# EAGLE schematic DinoCalc_1v0 (EAGLE 6.4)
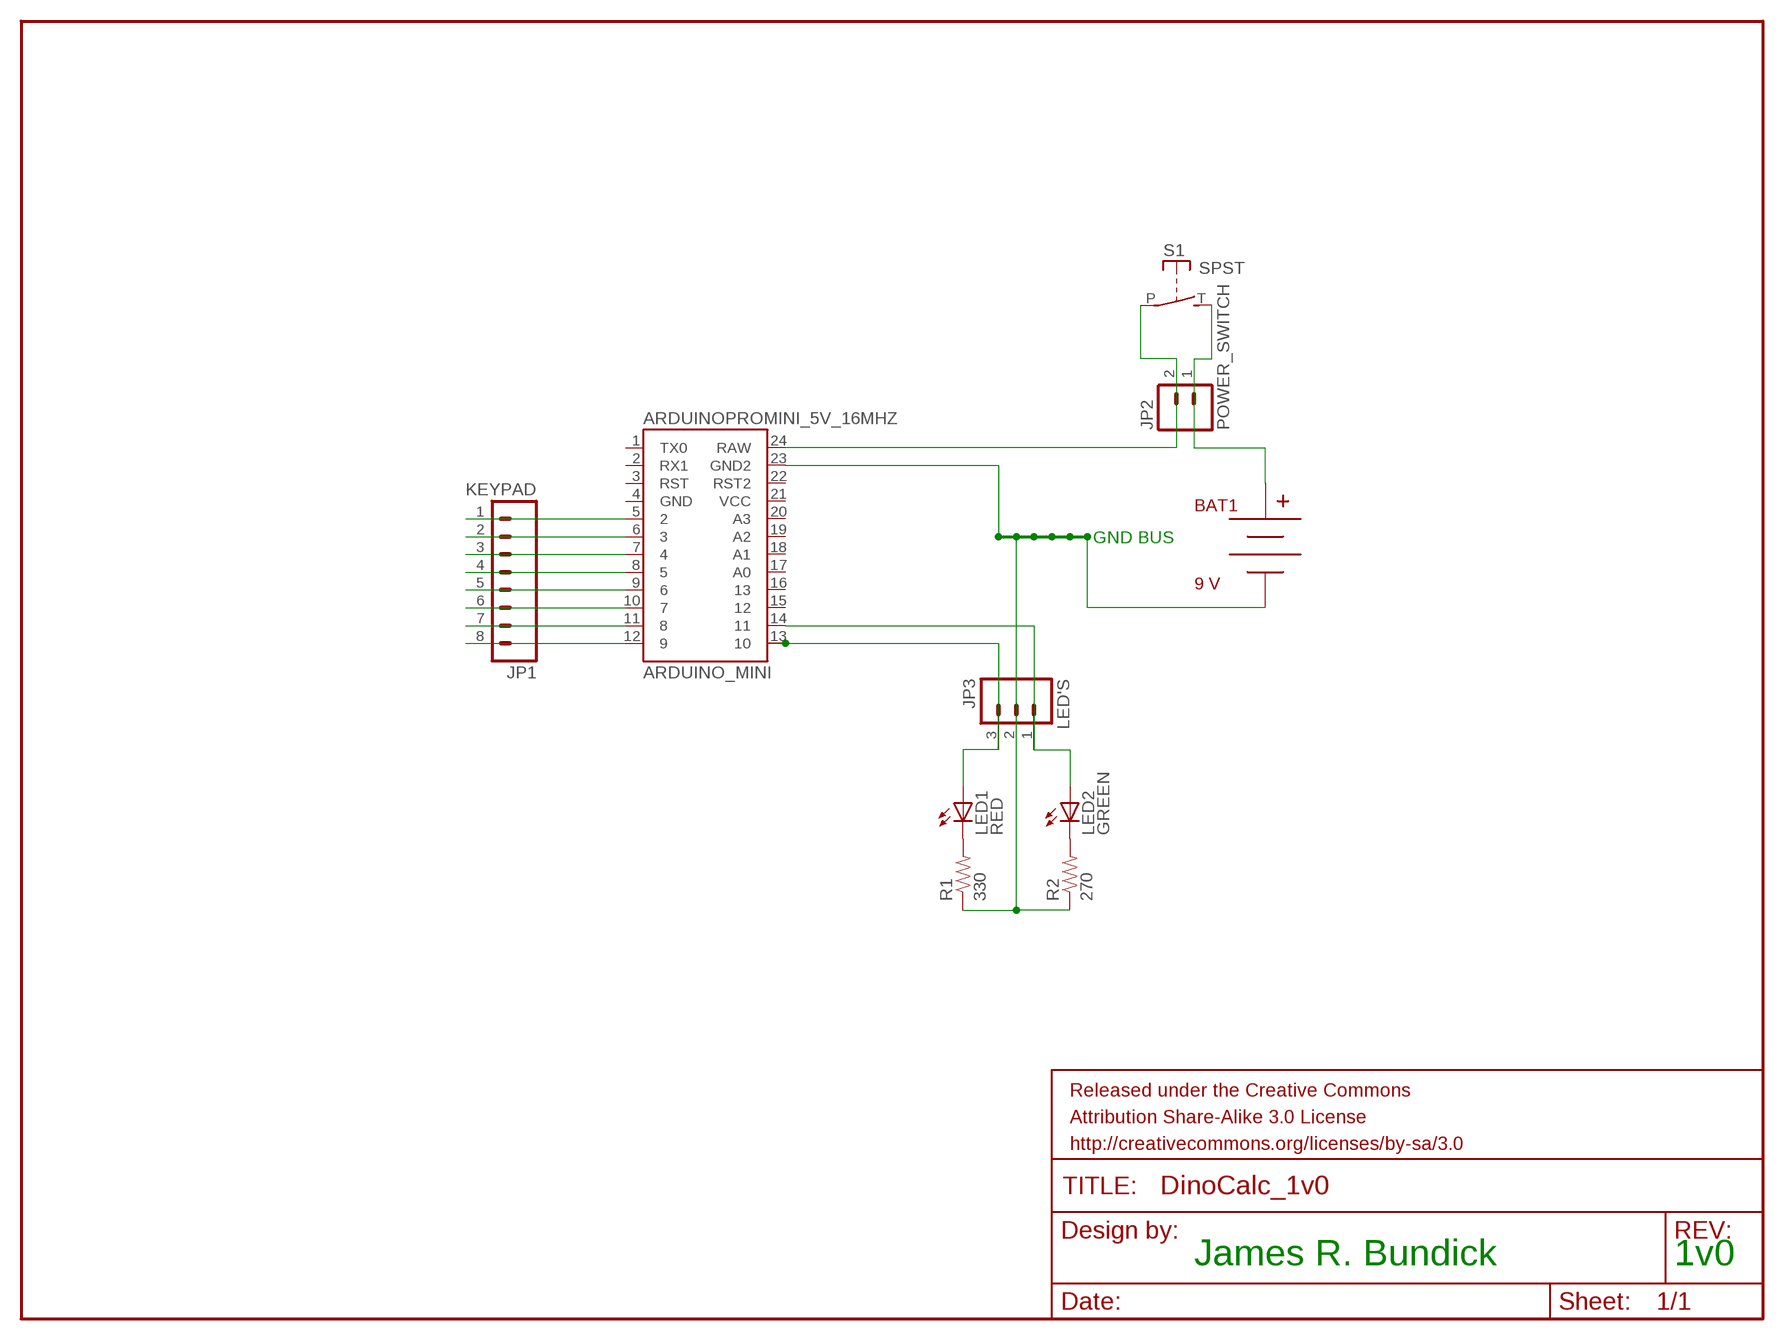
[diagram p0: schematic, sheet 1]

## Parts
ARDUINOPROMINI_5V_16MHZ  ARDUINO_MINI  [ARDUINO_MINI]
BAT1  9 V  BC9VPC  [BC9VPC]
FRAME1  FRAME-LETTER  [CREATIVE_COMMONS]
JP1  KEYPAD  M08LONGPADS  [1X08_LONGPADS]
JP2  POWER_SWITCH  M02PTH3  [1X02_LONGPADS]
JP3  LED'S  M03LONGPADS  [1X03_LONGPADS]
LED1  RED  LED5MM  [LED5MM]
LED2  GREEN  LED5MM  [LED5MM]
R1  330  RESISTORPTH-1/4W  [AXIAL-0.4]
R2  270  RESISTORPTH-1/4W  [AXIAL-0.4]
S1  SPST  [JUDCOSPST]

## Nets
N$1: ARDUINOPROMINI_5V_16MHZ.5 JP1.1
N$2: ARDUINOPROMINI_5V_16MHZ.6 JP1.2
N$3: ARDUINOPROMINI_5V_16MHZ.7 JP1.3
N$4: ARDUINOPROMINI_5V_16MHZ.8 JP1.4
N$5: ARDUINOPROMINI_5V_16MHZ.9 JP1.5
N$6: ARDUINOPROMINI_5V_16MHZ.10 JP1.6
N$7: ARDUINOPROMINI_5V_16MHZ.11 JP1.7
N$8: ARDUINOPROMINI_5V_16MHZ.12 JP1.8
N$9: ARDUINOPROMINI_5V_16MHZ.23(GND2) BAT1.V- JP3.2 R1.P$1 R2.P$1
N$10: BAT1.V+ JP2.1 S1.T(S)
N$11: ARDUINOPROMINI_5V_16MHZ.24(RAW) JP2.2 S1.P
N$12: LED1.K(C) R1.P$2
N$13: LED2.K(C) R2.P$2
N$14: ARDUINOPROMINI_5V_16MHZ.14 JP3.1 LED2.A
N$15: ARDUINOPROMINI_5V_16MHZ.13 JP3.3 LED1.A
Unconnected: ARDUINOPROMINI_5V_16MHZ.1(TX0) ARDUINOPROMINI_5V_16MHZ.2(RX1) ARDUINOPROMINI_5V_16MHZ.3(RST) ARDUINOPROMINI_5V_16MHZ.4(GND) ARDUINOPROMINI_5V_16MHZ.15 ARDUINOPROMINI_5V_16MHZ.16 ARDUINOPROMINI_5V_16MHZ.17(A0) ARDUINOPROMINI_5V_16MHZ.18(A1) ARDUINOPROMINI_5V_16MHZ.19(A2) ARDUINOPROMINI_5V_16MHZ.20(A3) ARDUINOPROMINI_5V_16MHZ.21(VCC) ARDUINOPROMINI_5V_16MHZ.22(RST2)

## Notes on the sheet
- GND BUS
- James R. Bundick | 1v0

## Library data of the parts
ARDUINOPROMINI_5V_16MHZ = SparkFun-Boards:ARDUINO_MINI: Arduino Pro Mini footprint
BAT1 = SparkFun-Connectors:BC9VPC: 9V board-mount battery cradle
FRAME1 = SparkFun-Aesthetics:FRAME-LETTER: Schematic Frame Standard 8.5x11 US Letter frame
JP1 = SparkFun-Connectors:M08: Header 8 Standard 8-pin 0.1" header. Use with straight break away headers (SKU : PRT-00116), right angle break away headers (PRT-00553), swiss pins (PRT-00743), machine pins (PRT-00117), and female headers (PRT-00115).
JP2 = SparkFun-Connectors:M02: Header 2 Standard 2-pin 0.1" header. Use with straight break away headers (SKU : PRT-00116), right angle break away headers (PRT-00553), swiss pins (PRT-00743), machine pins (PRT-00117), and female headers (PRT-00115). Molex polarized connector foot print use with SKU : PRT-08233 with associated crimp pins and housings.
JP3 = SparkFun-Connectors:M03: Header 3 Standard 3-pin 0.1" header. Use with straight break away headers (SKU : PRT-00116), right angle break away headers (PRT-00553), swiss pins (PRT-00743), machine pins (PRT-00117), and female headers (PRT-00115). Molex polarized connector foot print use with SKU : PRT-08232 with associated crimp pins and housings.
LED1 LED2 = adafruit:LED: LED OSRAM: - CHIPLED LG R971, LG N971, LY N971, LG Q971, LY Q971, LO R971, LY R971 LH N974, LH R974 LS Q976, LO Q976, LY Q976 LO Q996 - Hyper CHIPLED LW Q18S LB Q993, LB Q99A, LB R99A - SideLED LS A670, LO A670, LY A670, LG A670, LP A670 LB A673, LV A673, LT A673, LW A673 LH A674 LY A675 LS A676, LA A676, LO A676, LY A676, LW A676 LS A679, LY A679, LG A679 - Hyper Micro SIDELED® LS Y876, LA Y876, LO Y876, LY Y876 LT Y87S - SmartLED LW L88C, LW L88S LB L89C, LB L89S, LG L890 LS L89K, LO L89K, LY L89K LS L896, LA L896, LO L896, LY L896 - TOPLED LS T670, LO T670, LY T670, LG T670, LP T670 LSG T670, LSP T670, LSY T670, LOP T670, LYG T670 LG T671, LOG T671, LSG T671 LB T673, LV T673, LT T673, LW T673 LH T674 LS T676, LA T676, LO T676, LY T676, LB T676, LH T676, LSB T676, LW T676 LB T67C, LV T67C, LT T67C, LS T67K, LO T67K, LY T67K, LW E67C LS E67B, LA E67B, LO E67B, LY E67B, LB E67C, LV E67C, LT E67C LW T67C LS T679, LY T679, LG T679 LS T770, LO T770, LY T770, LG T770, LP T770 LB T773, LV T773, LT T773, LW T773 LH T774 LS E675, LA E675, LY E675, LS T675 LS T776, LA T776, LO T776, LY T776, LB T776 LHGB T686 LT T68C, LB T68C - Hyper Mini TOPLED® LB M676 - Mini TOPLED Santana® LG M470 LS M47K, LO M47K, LY M47K Source: http://www.osram.convergy.de/
R1 R2 = SparkFun-Resistors:RESISTOR: Resistor Basic schematic elements and footprints for 0603, 1206, and PTH resistors.
S1 = adafruit:SPST: Judco 50-0015-00